# Altium project 2014 12 12 DRIVER.PrjPCB
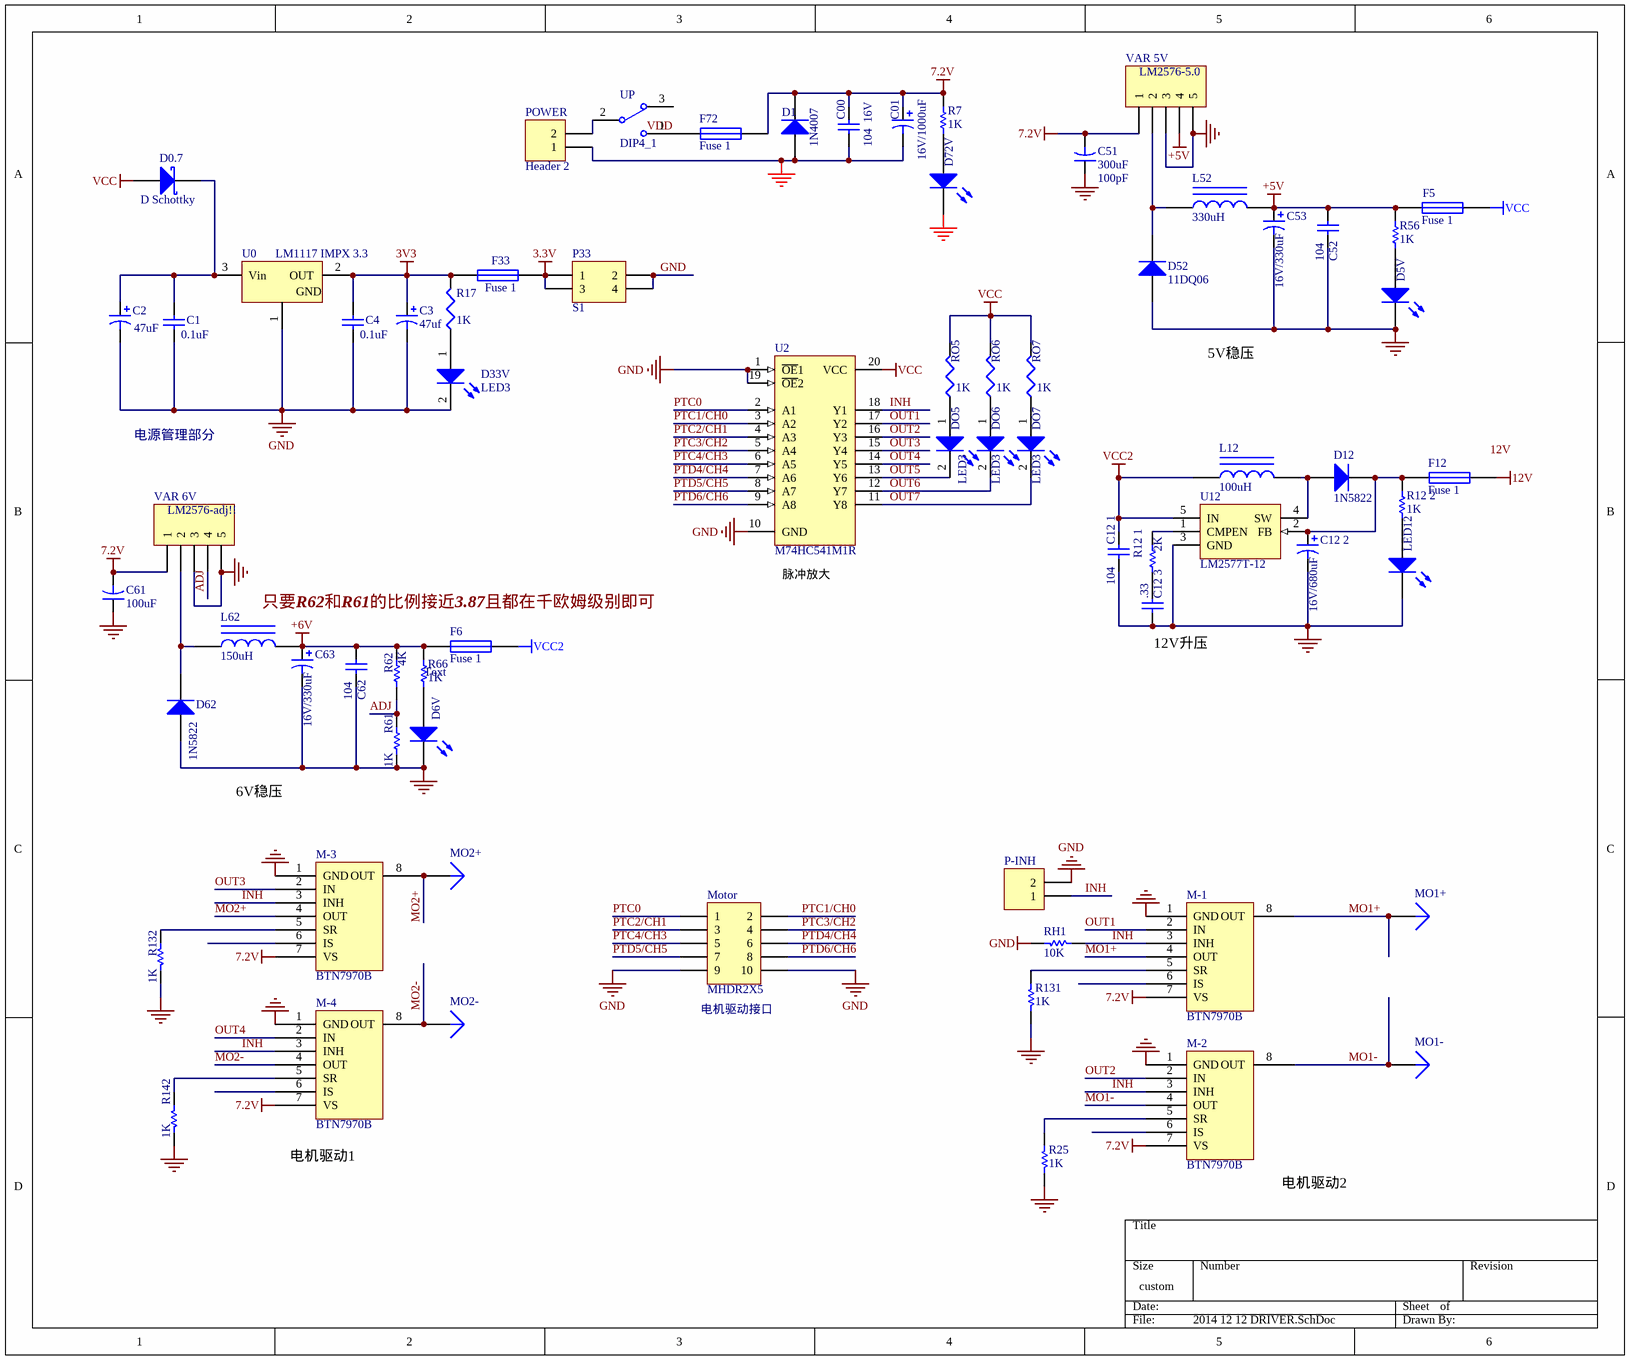
[diagram p0: 2014 12 12 DRIVER.SchDoc]
1 sheet, 70 parts. Net scope: global (net labels, ports and power ports of the same name join across sheets).
Board file: 2014 12 12 DRIVER.PcbDoc

## Sheet 2014 12 12 DRIVER.SchDoc
size 304 x 254 mm

### Parts
C00  104  16V  [2012[0805]]
C1  value 0.1uF  [1608[0603]]  (hidden comment: C1)
C01  value 16V/1000uF  [RAD-0.2]  (hidden comment: Cap Pol3)
C2  47uf  [CAPPR5-5x5]
C3  47uf  [CAPPR5-5x5]
C4  value 0.1uF  [1608[0603]]  (hidden comment: C1)
C12_1  104  [1608[0603]]
C12_2  value 16V/680uF  [RAD-0.1]  (hidden comment: Cap Pol3)
C12_3  .33  [1608[0603]]
C51  300uF  value 100pF  [CAPR5-4X5]
C52  104  [1608[0603]]
C53  value 16V/330uF  [RAD-0.2]  (hidden comment: Cap Pol3)
C61  100uF  [RAD-0.1]
C62  104  [1608[0603]]
C63  value 16V/330uF  [RAD-0.1]  (hidden comment: Cap Pol3)
D0.7  D Schottky  [SMB]
D1  1N4007  [DO-41]
D5V  LED3  [C1206]  (value not drawn)
D6V  LED3  [C1206]  (value not drawn)
D12  1N5822  [DO-35]
D33V  LED3  [3.2X1.6X1.1]
D52  11DQ06  [DO-35]
D62  1N5822  [DO-35]
D72V  LED3  [C1206]  (value not drawn)
DO5  LED3  [C1206]
DO6  LED3  [C1206]
DO7  LED3  [3.2X1.6X1.1]
F5  Fuse 1  [C1206]
F6  Fuse 1  [C1206]
F12  Fuse 1  [C1206]
F33  Fuse 1  [C1206]
F72  Fuse 1  [C1206]
L12  value 100uH  [RAD-0.2]  (hidden comment: Inductor Iron)
L52  value 330uH  [RAD-0.2]  (hidden comment: Inductor Iron)
L62  value 150uH  [RAD-0.2]  (hidden comment: Inductor Iron)
LED12  LED3  [C1206]  (value not drawn)
M-1  BTN7970B  [TO263-7]
M-2  BTN7970B  [TO263-7]
M-3  BTN7970B  [TO263-7]
M-4  BTN7970B  [TO263-7]
MO1+  (no value)  [PIN1]
MO1-  (no value)  [PIN1]
MO2+  (no value)  [PIN1]
MO2-  (no value)  [PIN1]
Motor  MHDR2X5  [IDC10S]
P33  S1  [HDR2X2]
P-INH  Header 2  [HDR1X2]  (value not drawn)
POWER  Header 2  [HDR1X2]
R7  value 1K  [2012[0805]]  (hidden comment: Res Semi)
R12_1  value 2K  [2012[0805]]  (hidden comment: Res Semi)
R12_2  value 1K  [2012[0805]]  (hidden comment: Res Semi)
R17  value 1K  [J1-0603]  (hidden comment: Res3)
R25  value 1K  [0805]  (hidden comment: Res Semi)
R56  value 1K  [2012[0805]]  (hidden comment: Res Semi)
R61  value 1K  [2012[0805]]  (hidden comment: Res Semi)
R62  value 4K  [2012[0805]]  (hidden comment: Res Semi)
R66  value 1K  [2012[0805]]  (hidden comment: Res Semi)
R131  value 1K  [2012[0805]]  (hidden comment: Res Semi)
R132  value 1K  [0805]  (hidden comment: Res Semi)
R142  value 1K  [0805]  (hidden comment: Res Semi)
RH1  value 10K  [0805]  (hidden comment: Res Semi)
RO5  value 1K  [J1-0603]  (hidden comment: Res3)
RO6  value 1K  [J1-0603]  (hidden comment: Res3)
RO7  value 1K  [J1-0603]  (hidden comment: Res3)
U0  LM1117 IMPX 3.3  [SOT89]
U2  M74HC541M1R  [SO20_M]
U12  LM2577T-12  [T05A]
UP  DIP4_1  [TL36WW15050]
VAR_5V  LM2576-5.0  [TO263-5]
VAR_6V  LM2576-adj!!  [TO263-5]

### Nets
3.3V: F33.1 P33.1 P33.3
3V3: C3.1 C4.2 F33.2 R17.2 U0.2(OUT)
7.2V: C00.2 C01.1 C51.2 C61.2 D1.2(K) F72.2 M-1.7(VS) M-2.7(VS) M-3.7(VS) M-4.7(VS) R7.2 VAR_5V.1 VAR_6V.1
12V: F12.1
+5V: C52.2 C53.1 F5.2 L52.2 R56.2 VAR_5V.4
+6V: C62.2 C63.1 F6.2 L62.2 R62.2 R66.2
GND: C00.1 C1.1 C01.2 C2.2 C3.2 C4.1 C12_1.1 C12_2.2 C12_3.1 C51.1 C52.1 C53.2 C61.1 C62.1 C63.2 D1.1(A) D5V.2(K) D6V.2(K) D33V.2(K) D52.1(A) D62.1(A) D72V.2(K) LED12.2(K) M-1.1(GND) M-2.1(GND) M-3.1(GND) M-4.1(GND) Motor.9 Motor.10 P33.2 P33.4 P-INH.2 POWER.1 R25.1 R61.1 R131.1 R132.1 R142.1 RH1.1 U0.1(Vin) U2.1(~{OE}1) U2.10(GND) U2.19(~{OE}2) U12.3(GND) VAR_5V.3 VAR_5V.5 VAR_6V.3 VAR_6V.5
VCC: D0.7.1(A) F5.1 RO5.2 RO6.2 RO7.2 U2.20(VCC)
VCC2: C12_1.2 F6.1 L12.1 U12.5(IN)
ADJ: R61.2 R62.1 VAR_6V.4
INH: M-1.3(INH) M-2.3(INH) M-3.3(INH) M-4.3(INH) P-INH.1 RH1.2 U2.18(Y1)
MO1+: M-1.4(OUT) M-1.8(OUT) MO1+.1
MO1-: M-2.4(OUT) M-2.8(OUT) MO1-.1
MO2+: M-3.4(OUT) M-3.8(OUT) MO2+.1
MO2-: M-4.4(OUT) M-4.8(OUT) MO2-.1
OUT1: M-1.2(IN) U2.17(Y2)
OUT2: M-2.2(IN) U2.16(Y3)
OUT3: M-3.2(IN) U2.15(Y4)
OUT4: M-4.2(IN) U2.14(Y5)
OUT5: DO5.2(K) U2.13(Y6)
OUT6: DO6.2(K) U2.12(Y7)
OUT7: DO7.2(K) U2.11(Y8)
PTC0: Motor.1 U2.2(A1)
PTC1/CH0: Motor.2 U2.3(A2)
PTC2/CH1: Motor.3 U2.4(A3)
PTC3/CH2: Motor.4 U2.5(A4)
PTC4/CH3: Motor.5 U2.6(A5)
PTD4/CH4: Motor.6 U2.7(A6)
PTD5/CH5: Motor.7 U2.8(A7)
PTD6/CH6: Motor.8 U2.9(A8)
NetC1_2: C1.2 C2.1 D0.7.2(K) U0.3(Vin)
NetC12_2_1: C12_2.1 D12.2(K) F12.2 R12_2.2 U12.2(FB)
NetC12_3_2: C12_3.2 R12_1.1
NetD5V_1: D5V.1(A) R56.1
NetD6V_1: D6V.1(A) R66.1
NetD12_1: D12.1(A) L12.2 U12.4(SW)
NetD33V_1: D33V.1(A) R17.1
NetD52_2: D52.2(K) L52.1 VAR_5V.2
NetD62_2: D62.2(K) L62.1 VAR_6V.2
NetD72V_1: D72V.1(A) R7.1
NetDO5_1: DO5.1(A) RO5.1
NetDO6_1: DO6.1(A) RO6.1
NetDO7_1: DO7.1(A) RO7.1
NetF72_1: F72.1 UP.1
NetLED12_1: LED12.1(A) R12_2.1
NetM-1_5: M-1.5(SR) R131.2
NetM-2_5: M-2.5(SR) R25.2
NetM-3_5: M-3.5(SR) R132.2
NetM-4_5: M-4.5(SR) R142.2
NetPOWER_2: POWER.2 UP.2
NetR12_1_2: R12_1.2 U12.1(CMPEN)

Not connected (* = marked no-connect by the designer): M-1 6(IS); M-2 6(IS); M-3 6(IS); M-4 6(IS); UP 3

### Notes on the sheet
- 5V稳压
- 电源管理部分
- 只要R62和R61的比例接近3.87且都在千欧姆级别即可
- (near U2) 脉冲放大
- (near R66) Text
- (near C12_3) 12V升压
- 6V稳压
- (near Motor) 电机驱动接口
- (near M-4) 电机驱动1
- (near M-2) 电机驱动2
- Labels drawn without touching a wire or pin: 12V, VDD
- (in symbol Volt Reg) GND

### Library data of the parts
C00 C12_1 C12_3 C52 C62 = Cap Semi: Capacitor (Semiconductor SIM Model); Value: 100pF; Published: 8-Jun-2000; LatestRevisionDate: 17-Jul-2002; LatestRevisionNote: Re-released for DXP Platform.; PackageReference: C1206; Publisher: Altium Limited
C1 C4 = Cap Semi: Capacitor (Semiconductor SIM Model); Published: 8-Jun-2000; LatestRevisionDate: 17-Jul-2002; LatestRevisionNote: Re-released for DXP Platform.; PackageReference: C1206; Publisher: Altium Limited
C01 C2 C12_2 C53 C63 = Cap Pol3: Polarized Capacitor (Surface Mount); Published: 8-Jun-2000; LatestRevisionDate: 17-Jul-2002; LatestRevisionNote: Re-released for DXP Platform.; PackageReference: C0805; Publisher: Altium Limited
  C2: Value: 47uF
C3 = Cap Pol1: Polarized Capacitor (Radial); Published: 8-Jun-2000; LatestRevisionDate: 17-Jul-2002; LatestRevisionNote: Re-released for DXP Platform.; Publisher: Altium Limited
C51 = Cap2: Capacitor; Published: 23-Sep-2002; PackageReference: CAPR5-4X5; Publisher: Altium Limited
C61 = Cap2: Capacitor; Value: 100pF; Published: 23-Sep-2002; PackageReference: CAPR5-4X5; Publisher: Altium Limited
D0.7 = D Schottky: Schottky Diode; Published: 8-Jun-2000; LatestRevisionDate: 17-Jul-2002; LatestRevisionNote: Re-released for DXP Platform.; PackageReference: SMB; Publisher: Altium Limited; Code_JEDEC: DO-214-AA
D1 D12 D52 D62 = Diode 1N4007: 1 Amp General Purpose Rectifier; Published: 8-Jun-2000; LatestRevisionDate: 17-Jul-2002; LatestRevisionNote: Re-released for DXP Platform.; DatasheetDocument: 1998; PackageDocument: Aug-1999; PackageReference: DO-41; Publisher: Altium Limited; Code_JEDEC: DO-204-AL; ComponentLink1Description: Manufacturer Link; ComponentLink1URL: http://www.fairchildsemi.com/; ComponentLink2Description: Datasheet; ComponentLink2URL: http://www.fairchildsemi.com/ds/1N%2F1N4001.pdf
D5V D6V D33V D72V DO5-DO7 LED12 = LED3: Typical BLUE SiC LED; Published: 8-Jun-2000; LatestRevisionDate: 17-Dec-2003; LatestRevisionNote: PCB Footprint replaced.; DatasheetDocument: 16-Apr-2002; PackageDocument: 16-Apr-2002; PackageReference: 3.5X2.8X1.9; Publisher: Altium Limited
F5 F6 F12 F33 F72 = Fuse 1: Fuse; Published: 8-Jun-2000; LatestRevisionDate: 17-Jul-2002; LatestRevisionNote: Re-released for DXP Platform.; PackageReference: PIN-W2/E2.8; Publisher: Altium Limited
L12 L52 L62 = Inductor Iron: Magnetic-Core Inductor; Published: 24-Mar-1999; LatestRevisionDate: 17-Jul-2002; LatestRevisionNote: Re-released for DXP Platform.; PackageReference: AXIAL-0.9; Publisher: Altium Limited
M-1-M-4 = Component_1
MO1+ MO1- MO2+ MO2- = Plug: LatestRevisionDate: 17-Jul-2002; LatestRevisionNote: Re-released for DXP Platform.; Publisher: Altium Limited
Motor = MHDR2X5: Header, 5-Pin, Dual row; LatestRevisionDate: 17-Jul-2002; LatestRevisionNote: Re-released for DXP Platform.; Publisher: Altium Limited
P33 = Header 2X2: Header, 2-Pin, Dual row; LatestRevisionDate: 17-Jul-2002; LatestRevisionNote: Re-released for DXP Platform.; Publisher: Altium Limited
P-INH POWER = Header 2: Header, 2-Pin; LatestRevisionDate: 17-Jul-2002; LatestRevisionNote: Re-released for DXP Platform.; Publisher: Altium Limited
R7 R12_1 R12_2 R25 R56 R61 R62 R66 R131 R132 R142 RH1 = Res Semi: Semiconductor Resistor; Published: 8-Jun-2000; LatestRevisionDate: 17-Jul-2002; LatestRevisionNote: Re-released for DXP Platform.; PackageReference: AXIAL-0.5; Publisher: Altium Limited
R17 RO5-RO7 = Res3: Resistor; Published: 8-Jun-2000; LatestRevisionDate: 04-Mar-2005; LatestRevisionNote: PCB Footprint replaced.; PackageReference: J1-0603; Publisher: Altium Limited
U0 = Volt Reg: Voltage Regulator; Published: 24-Mar-1999; LatestRevisionDate: 17-Jul-2002; LatestRevisionNote: Re-released for DXP Platform.; PackageReference: D2PAK; Publisher: Altium Limited; Code_JEDEC: SMD-220
U2 = M74HC541M1R: Octal Bus Buffer with 3 State Outputs (Non Inverted); Published: 8-Jun-2000; LatestRevisionDate: 13-Apr-2006; LatestRevisionNote: IPC-7351 Footprint Added.; DatasheetVersion: Oct-1993; PackageVersion: Jul-2001; PackageReference: SO20; Publisher: Altium Limited; PackageDescription: 20-Pin Plastic Small Outline Integrated Circuit 1.27 mm Pitch; Code_JEDEC: MS-013-AC; Code_IPC: SOIC127P1030-20; ComponentLink1Description: Manufacturer Link; ComponentLink1URL: http://www.st.com/
U12 = LM2577T-12: Simple Switcher Step Up Voltage Regulator; Note: Tab is connected to GND; Published: 15-Apr-2002; DatasheetVersion: Jun-1999; PackageVersion: 2000; PackageReference: T05A; Publisher: Altium Limited; PackageDescription: TO, Thru-Hole, Vertical, Heatsink Mounted; 5 In-Line Leads; Pitch 1.70 mm; Code_JEDEC: TS-001-AA; ComponentLink1Description: Manufacturer Link; ComponentLink1URL: http://www.national.com/; ComponentLink2Description: Datasheet; ComponentLink2URL: http://www.national.com/ds.cgi/LM/LM1577.pdf; ComponentLink3Description: URL Link1; ComponentLink3URL: http://www.national.com/pf/LM/LM2577.html
UP = SW-SPDT: SPDT Subminiature Toggle Switch, Right Angle Mounting, Vertical Actuation; Published: 24-Mar-1999; LatestRevisionDate: 17-Dec-2003; LatestRevisionNote: Schematic revised, PCB Footprint replaced.; DatasheetDocument: 05-Dec-2000; PackageReference: TL36WW15050; Publisher: Altium Limited; ComponentLink1Description: Manufacturer Link; ComponentLink1URL: http://www.apem.com
VAR_5V VAR_6V = Header 5: Header, 5-Pin; LatestRevisionDate: 17-Jul-2002; LatestRevisionNote: Re-released for DXP Platform.; Publisher: Altium Limited